# EAGLE design arduino_uno_pcb _with_lcd (EAGLE 6.1)
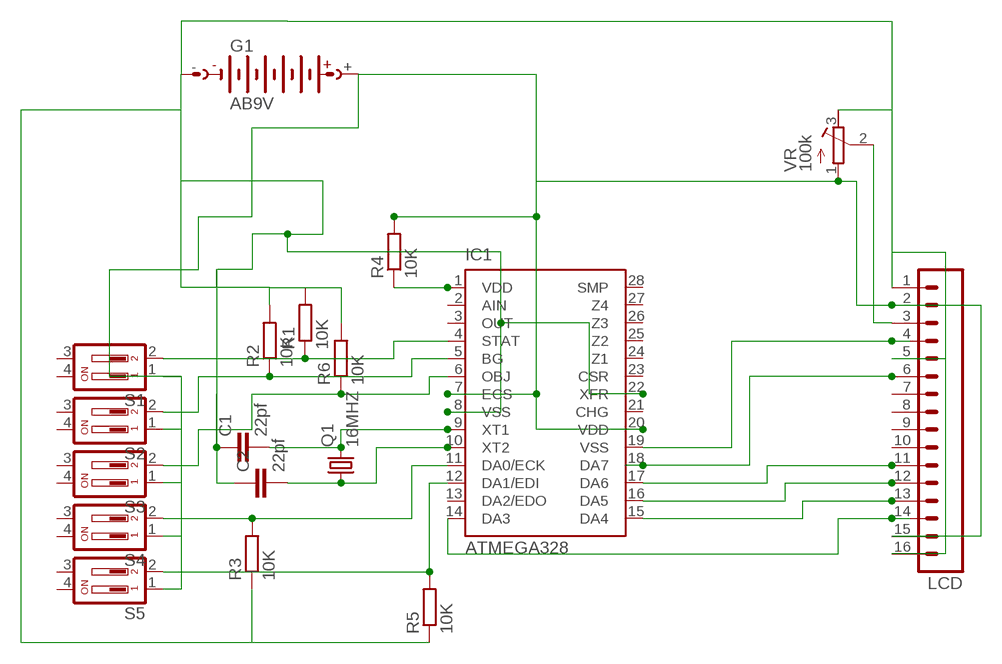
[diagram p0: schematic, sheet 1]

## Parts
C1  22pf  C2.5/2  [C2.5-2]
C2  22pf  C2.5/2  [C2.5-2]
G1  AB9V  [AB9V]
IC1  ATMEGA328  QT9701BD  [DIL28-3]
LCD  M16  [16P]
Q1  16MHZ  CRYSTALHC49S  [HC49/S]
R1  10K  R-EU_0207/10  [0207/10]
R2  10K  R-EU_0207/10  [0207/10]
R3  10K  R-EU_0207/10  [0207/10]
R4  10K  R-EU_0207/10  [0207/10]
R5  10K  R-EU_0207/10  [0207/10]
R6  10K  R-EU_0207/10  [0207/10]
S1  DP02  [DP-02]
S2  DP02  [DP-02]
S3  DP02  [DP-02]
S4  DP02  [DP-02]
S5  DP02  [DP-02]
VR  100k  R-TRIMM64P  [RTRIM64P]

## Nets
N$1: C1.2 IC1.9(XT1) Q1.2
N$2: C2.2 IC1.10(XT2) Q1.1
N$3: G1.+ IC1.7(ECS) IC1.20(VDD) LCD.2 LCD.15 R4.2 S1.1 S2.1 S3.1 S4.1 S5.1 VR.1(E)
N$4: IC1.11(DA0/ECK) R3.2 S4.2
N$5: IC1.4(STAT) R1.1 S1.2
N$6: C1.1 C2.1 G1.- IC1.8(VSS) IC1.22(XFR) LCD.1 LCD.5 LCD.16 R1.2 R2.2 R3.1 R5.1 R6.2 VR.3(A)
N$7: IC1.5(BG) R2.1 S2.2
N$8: IC1.6(OBJ) R6.1 S3.2
N$9: IC1.12(DA1/EDI) R5.2 S5.2
N$22: LCD.3 VR.2(S)
N$23: IC1.19(VSS) LCD.4
N$24: IC1.18(DA7) LCD.6
N$25: IC1.17(DA6) LCD.11
N$26: IC1.16(DA5) LCD.12
N$27: IC1.15(DA4) LCD.13
N$29: IC1.14(DA3) LCD.14
N$31: IC1.1(VDD) R4.1
Unconnected: IC1.2(AIN) IC1.3(OUT) IC1.13(DA2/EDO) IC1.21(CHG) IC1.23(CSR) IC1.24(Z1) IC1.25(Z2) IC1.26(Z3) IC1.27(Z4) IC1.28(SMP) LCD.7 LCD.8 LCD.9 LCD.10 S1.3 S1.4 S2.3 S2.4 S3.3 S3.4 S4.3 S4.4 S5.3 S5.4

## Library data of the parts
C1 C2 = capacitor-wima:C: CAPACITOR naming: grid - package width
G1 = battery:AB9V: 9-V BATTERY CLIP
IC1 = quantum-research-group:QT9701B: Charge-Transfer Capacitance Sensor IC Source: http://data.qprox.com/downloads/datasheets/qt9701b.pdf; OC_FARNELL: unknown; OC_NEWARK: unknown
LCD = con-amp-quick:M16: AMP QUICK CONNECTOR; OC_FARNELL: unknown; OC_NEWARK: unknown
Q1 = crystal:CRYSTAL: CRYSTAL; OC_FARNELL: 1667008; OC_NEWARK: unknown
R1-R6 = rcl:R-EU_: RESISTOR, European symbol
S1-S5 = switch-dil:DP02: DIL/CODE SWITCH; MPN: MCDP02; OC_FARNELL: 1255233; OC_NEWARK: 26M1095
VR = resistor:R-TRIMM: Trimm resistor

## Board
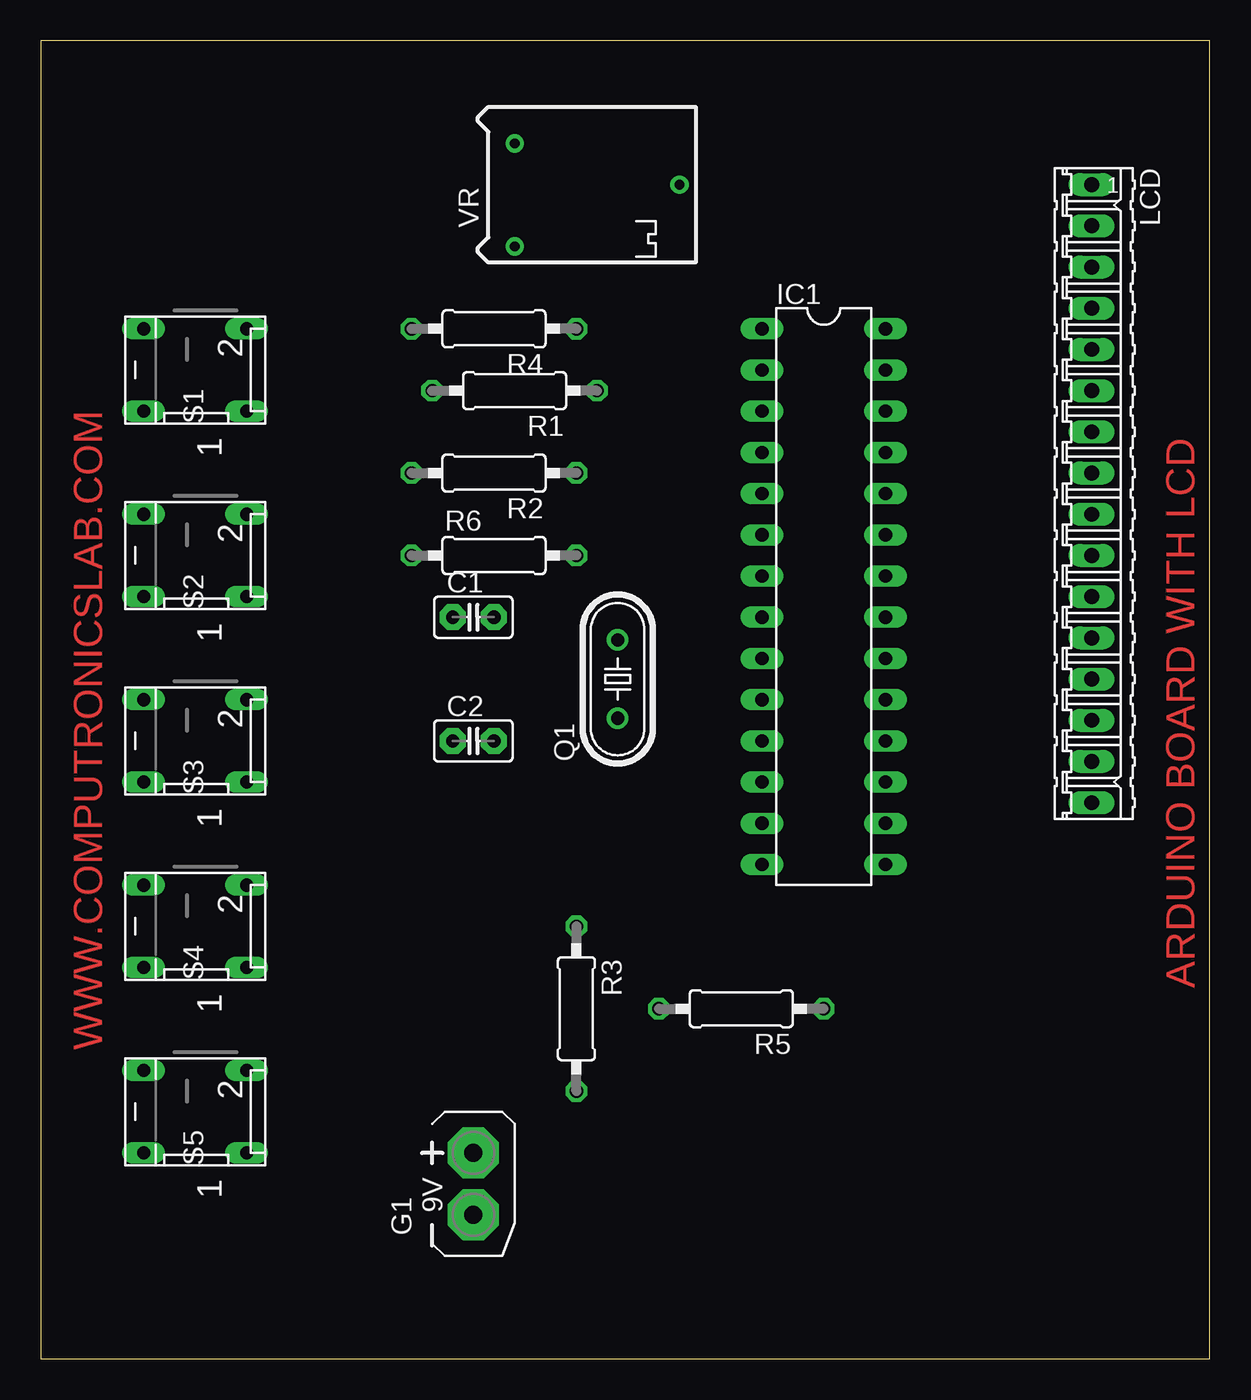
[diagram p1: board, top side]
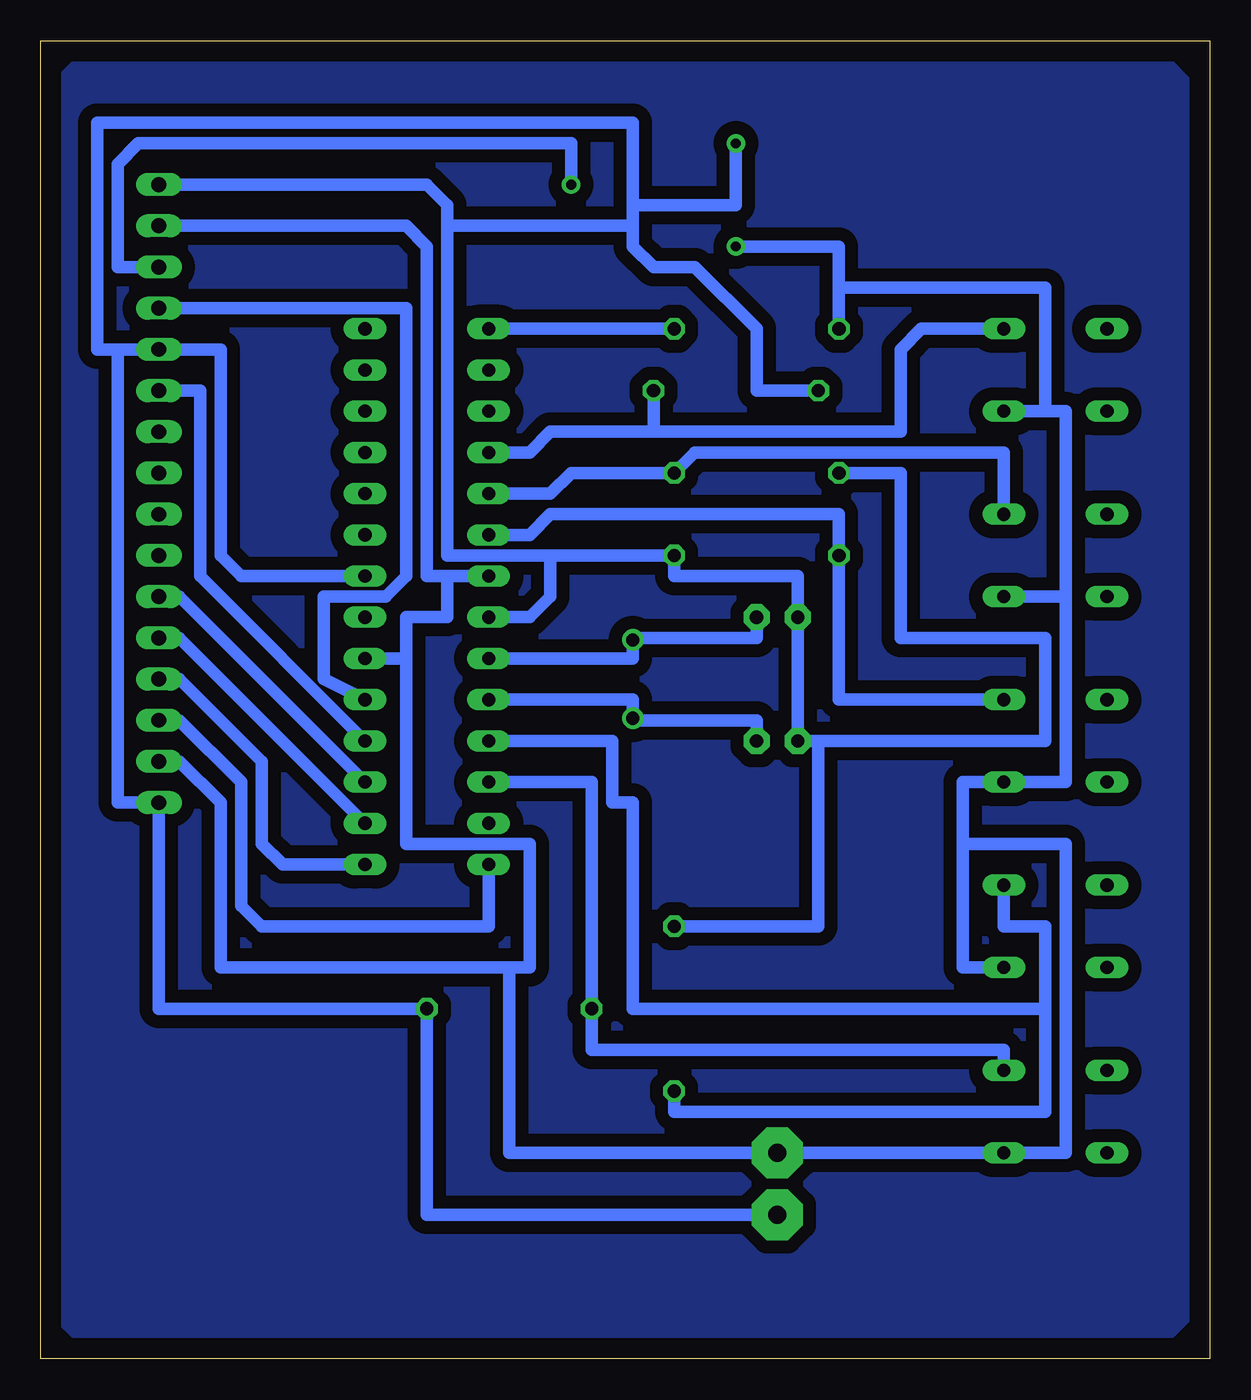
[diagram p2: board, bottom side, seen from below]

Size 72.06 x 81.27 mm. Coordinates in mm from the lower left corner, seen from the top.
Outline: 0,0 72.06,0 72.06,81.27 0,81.27 0,0
Copper layers (1*16): Top 0.04mm / dielectric 1.5mm / Bottom 0.04mm
Design rules: minimum track width 30mil, minimum drill 35mil, track to track 8mil, track to pad 8mil, pad to pad 8mil, via to via 8mil, smd to smd 8mil, copper to edge 50mil, drill to drill 8mil, minimum pad ring 10mil, minimum via ring 8mil, stop-mask expansion 4mil, vias tented up to drill 0mil, thermal gap 10mil

### Footprints (pad centres in the part's own frame; a part is rotated, then mirrored left to right if it is on the bottom)
C2.5-2 = drill 0.813 pad 1.6 octagon: 1 -1.27,0; 2 1.27,0
AB9V = drill 1.118 pad 3.15 octagon: + 0,2.54; - 0,-1.27
DIL28-3 = drill 0.813 long: 1 -16.51,-3.81; 2 -13.97,-3.81; 3 -11.43,-3.81; 4 -8.89,-3.81; 5 -6.35,-3.81; 6 -3.81,-3.81; 7 -1.27,-3.81; 8 1.27,-3.81; 9 3.81,-3.81; 10 6.35,-3.81; 11 8.89,-3.81; 12 11.43,-3.81; 13 13.97,-3.81; 14 16.51,-3.81; 15 16.51,3.81; 16 13.97,3.81; 17 11.43,3.81; 18 8.89,3.81; 19 6.35,3.81; 20 3.81,3.81; 21 1.27,3.81; 22 -1.27,3.81; 23 -3.81,3.81; 24 -6.35,3.81; 25 -8.89,3.81; 26 -11.43,3.81; 27 -13.97,3.81; 28 -16.51,3.81
16P = drill 0.914 long: 1 -19.05,0; 2 -16.51,0; 3 -13.97,0; 4 -11.43,0; 5 -8.89,0; 6 -6.35,0; 7 -3.81,0; 8 -1.27,0; 9 1.27,0; 10 3.81,0; 11 6.35,0; 12 8.89,0; 13 11.43,0; 14 13.97,0; 15 16.51,0; 16 19.05,0
HC49/S = drill 0.813: 1 -2.413,0; 2 2.413,0
0207/10 = drill 0.813 octagon: 1 -5.08,0; 2 5.08,0
DP-02 = drill 0.813 long: 1 -2.54,-2.54; 2 2.54,-2.54; 3 2.54,3.81; 4 -2.54,3.81
RTRIM64P = drill 0.61: 1 -2.54,-3.81; 2 7.62,0; 3 -2.54,2.54

### Placement (x,y rotation side)
C1  26.67,45.72 0 top
C2  26.67,38.1 0 top
G1  26.67,10.16 0 top
IC1  48.26,46.99 270 top
LCD  64.77,53.34 270 top
Q1  35.56,41.91 90 top
R1  29.21,59.69 180 top
R2  27.94,54.61 180 top
R3  33.02,21.59 270 top
R4  27.94,63.5 180 top
R5  43.18,21.59 180 top
R6  27.94,49.53 0 top
S1  10.16,60.96 90 top
S2  10.16,49.53 90 top
S3  10.16,38.1 90 top
S4  10.16,26.67 90 top
S5  10.16,15.24 90 top
VR  31.75,72.39 0 top

### Tracks (layer width: path | path; a pad name or v marks a point on that pad's centre or on a via)
N$1
  Bottom 0.762: 35.56,44.45 27.94,44.45 C1.2 | 35.56,44.45 Q1.2 35.56,44.45 | IC1.9 35.56,43.18 35.56,44.45
N$2
  Bottom 0.762: 35.56,39.37 27.94,39.37 C2.2 | 35.56,39.37 Q1.1 35.56,39.37 | IC1.10 35.56,40.64 35.56,39.37
N$3
  Bottom 0.762: S4.1 15.24,24.13 15.24,29.21 15.24,31.75 | 15.24,31.75 15.24,35.56 S3.1 8.89,35.56 8.89,46.99 | 22.86,66.04 22.86,68.58 VR.1 | 22.86,66.04 R4.2 22.86,66.04 | 8.89,46.99 S2.1 | 8.89,46.99 8.89,58.42 10.16,58.42 | S1.1 10.16,58.42 | 22.86,66.04 10.16,66.04 10.16,63.5 10.16,58.42 | 49.53,43.18 49.53,45.72 46.99,45.72 46.99,48.26 IC1.7 48.26,48.26 48.26,66.04 48.26,68.58 49.53,69.85 52.07,69.85 LCD.2 | IC1.20 49.53,43.18 | LCD.15 63.5,36.83 60.96,34.29 60.96,24.13 41.91,24.13 | 41.91,24.13 43.18,24.13 43.18,12.7 31.75,12.7 G1.+ S5.1 8.89,12.7 8.89,29.21 8.89,31.75 10.16,31.75 15.24,31.75 | 49.53,43.18 49.53,31.75 43.18,31.75 41.91,31.75 41.91,30.48 41.91,24.13
N$4
  Bottom 0.762: R3.2 33.02,15.24 10.16,15.24 10.16,17.78 10.16,21.59 | 10.16,21.59 10.16,26.67 12.7,26.67 S4.2 | 35.56,33.02 35.56,21.59 34.29,21.59 10.16,21.59 | 35.56,33.02 35.56,34.29 | 35.56,34.29 35.56,33.02 | 35.56,33.02 35.56,34.29 | 35.56,34.29 36.83,34.29 36.83,38.1 IC1.11
N$5
  Bottom 0.762: 34.29,57.15 38.1,57.15 | 38.1,57.15 40.64,57.15 41.91,55.88 IC1.4 | R1.1 34.29,57.15 | S1.2 17.78,63.5 19.05,62.23 19.05,57.15 34.29,57.15 | 38.1,57.15 34.29,57.15
N$6
  Bottom 0.762: IC1.22 57.15,48.26 59.69,48.26 60.96,49.53 60.96,52.07 60.96,57.15 60.96,62.23 LCD.5 66.04,62.23 67.31,62.23 | G1.- 35.56,8.89 48.26,8.89 R5.1 64.77,21.59 LCD.16 | 67.31,62.23 67.31,60.96 67.31,34.29 | LCD.16 67.31,34.29 | VR.3 29.21,71.12 33.02,71.12 35.56,71.12 | 46.99,71.12 48.26,72.39 63.5,72.39 LCD.1 | 46.99,71.12 46.99,69.85 35.56,69.85 35.56,71.12 | 35.56,71.12 35.56,68.58 34.29,67.31 31.75,67.31 27.94,63.5 27.94,59.69 R1.2 | 40.64,49.53 40.64,46.99 41.91,45.72 IC1.8 | 40.64,49.53 34.29,49.53 R6.2 33.02,48.26 25.4,48.26 C1.1 C2.1 24.13,38.1 | R3.1 24.13,26.67 24.13,35.56 24.13,38.1 | R2.2 19.05,54.61 19.05,44.45 10.16,44.45 10.16,41.91 10.16,40.64 10.16,39.37 10.16,38.1 12.7,38.1 24.13,38.1 | 46.99,71.12 46.99,49.53 40.64,49.53 | 67.31,34.29 LCD.16 | 67.31,62.23 67.31,34.29 | 67.31,62.23 68.58,62.23 68.58,76.2 40.64,76.2 35.56,76.2 35.56,71.12
N$7
  Bottom 0.762: S2.2 12.7,55.88 31.75,55.88 R2.1 39.37,54.61 40.64,53.34 IC1.5
N$8
  Bottom 0.762: S3.2 22.86,40.64 R6.1 22.86,52.07 40.64,52.07 41.91,50.8 IC1.6
N$9
  Bottom 0.762: S5.2 12.7,19.05 38.1,19.05 R5.2 38.1,29.21 38.1,34.29 38.1,35.56 IC1.12
N$10
  pour Bottom (isolate 0.813): 5.08,0 3.81,0 0,3.81 0,77.47 3.81,81.28 68.58,81.28 72.39,77.47 72.39,3.81 68.58,0
N$22
  Bottom 0.762: VR.2 39.37,74.93 41.91,74.93 66.04,74.93 67.31,73.66 67.31,67.31 LCD.3
N$23
  Bottom 0.762: IC1.19 54.61,41.91 54.61,43.18 54.61,46.99 50.8,46.99 49.53,48.26 49.53,64.77 LCD.4
N$24
  Bottom 0.762: IC1.18 62.23,48.26 62.23,59.69 LCD.6
N$25
  Bottom 0.762: IC1.17 63.5,46.99 LCD.11
N$26
  Bottom 0.762: IC1.16 63.5,44.45 LCD.12
N$27
  Bottom 0.762: IC1.15 57.15,30.48 58.42,31.75 58.42,35.56 58.42,36.83 63.5,41.91 LCD.13
N$29
  Bottom 0.762: IC1.14 44.45,26.67 54.61,26.67 58.42,26.67 59.69,27.94 59.69,33.02 59.69,35.56 63.5,39.37 LCD.14
N$31
  Bottom 0.762: IC1.1 R4.1

### Text on the board
Top: ARDUINO BOARD WITH LCD | WWW.COMPUTRONICSLAB.COM